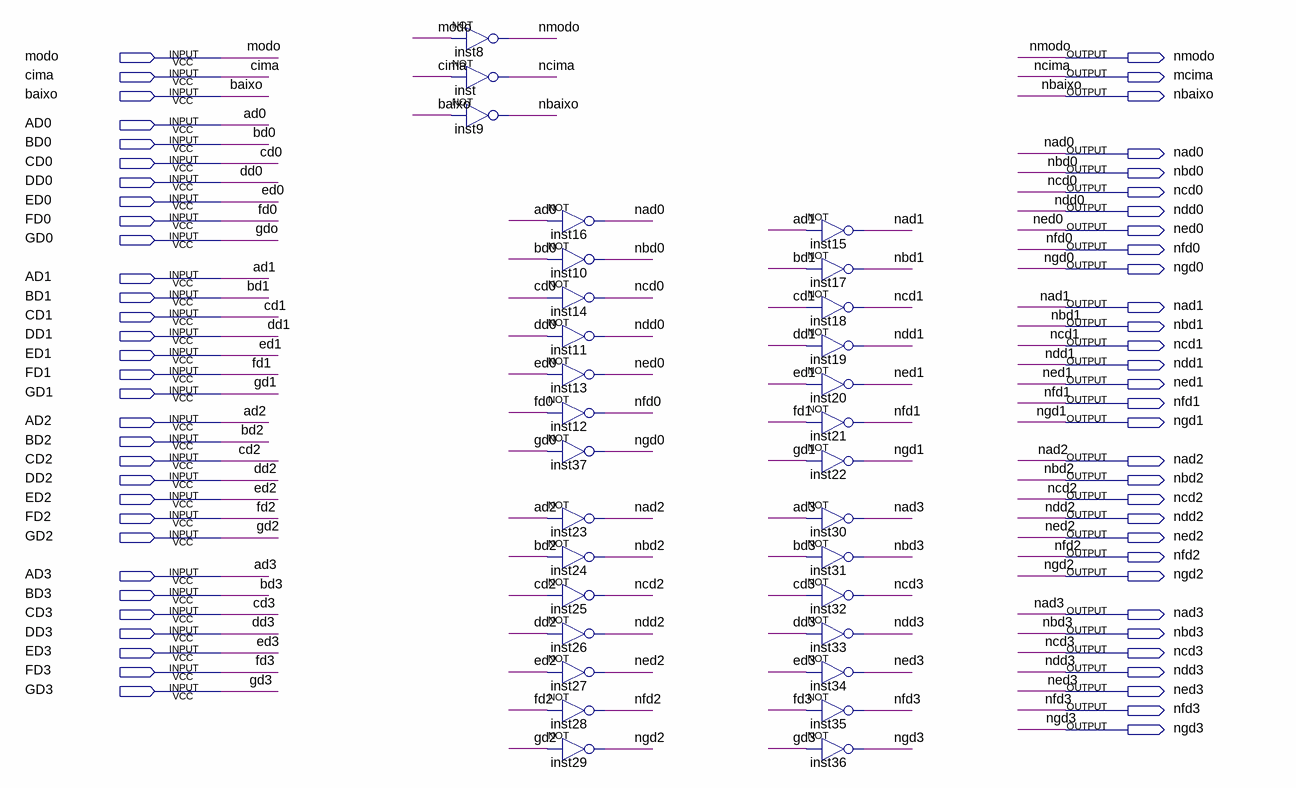
[diagram p0: schematic sheet]
// Quartus schematic negado.bdf as structural Verilog: 31 symbols, 62 pins
module negado (
  input  modo,
  input  cima,
  input  baixo,
  input  AD0,
  input  BD0,
  input  CD0,
  input  DD0,
  input  ED0,
  input  FD0,
  input  GD0,
  input  AD1,
  input  BD1,
  input  CD1,
  input  DD1,
  input  ED1,
  input  FD1,
  input  GD1,
  input  AD2,
  input  BD2,
  input  CD2,
  input  DD2,
  input  ED2,
  input  FD2,
  input  GD2,
  input  AD3,
  input  BD3,
  input  CD3,
  input  DD3,
  input  ED3,
  input  FD3,
  input  GD3,
  output nmodo,
  output mcima,
  output nbaixo,
  output nad0,
  output nbd0,
  output ncd0,
  output ndd0,
  output ned0,
  output nfd0,
  output ngd0,
  output nad1,
  output nbd1,
  output ncd1,
  output ndd1,
  output ned1,
  output nfd1,
  output ngd1,
  output nad2,
  output nbd2,
  output ncd2,
  output ndd2,
  output ned2,
  output nfd2,
  output ngd2,
  output nad3,
  output nbd3,
  output ncd3,
  output ndd3,
  output ned3,
  output nfd3,
  output ngd3
);

  not inst8 (nmodo, modo);
  not inst (mcima, cima);
  not inst9 (nbaixo, baixo);
  not inst16 (nad0, AD0);
  not inst10 (nbd0, BD0);
  not inst14 (ncd0, CD0);
  not inst11 (ndd0, DD0);
  not inst13 (ned0, ED0);
  not inst12 (nfd0, FD0);
  not inst37 (ngd0, GD0);
  not inst23 (nad2, AD2);
  not inst24 (nbd2, BD2);
  not inst25 (ncd2, CD2);
  not inst26 (ndd2, DD2);
  not inst27 (ned2, ED2);
  not inst28 (nfd2, FD2);
  not inst29 (ngd2, GD2);
  not inst15 (nad1, AD1);
  not inst17 (nbd1, BD1);
  not inst18 (ncd1, CD1);
  not inst19 (ndd1, DD1);
  not inst20 (ned1, ED1);
  not inst21 (nfd1, FD1);
  not inst22 (ngd1, GD1);
  not inst30 (nad3, AD3);
  not inst31 (nbd3, BD3);
  not inst32 (ncd3, CD3);
  not inst33 (ndd3, DD3);
  not inst34 (ned3, ED3);
  not inst35 (nfd3, FD3);
  not inst36 (ngd3, GD3);

  // Other names for the same wires on the sheet: gdo = GD0; ncima = mcima
endmodule
